# Altium schematic sheet CHANNEL_DELAY.SchDoc: Programmable delay
size 297 x 209 mm; CheckedBy: -; CompanyName: CERN; DrawnBy: GK; Organization: CERN; Address1: European Organization for Nuclear Research; Address2: CH-1211 Geneve 23 - Switzerland; Revision: -; SheetNumber: 8; SheetTotal: 9; EDA_Number: EDA-XXXXX-VX-X; Projet: FMC Delay 1ns 4cha; ModifiedBy: -; CreateDate: XX/XX/XXXX; CheckedDate: -; Title2: Title2; DivGrp: BE-CO; Designer: GK; ModifiedDate: -
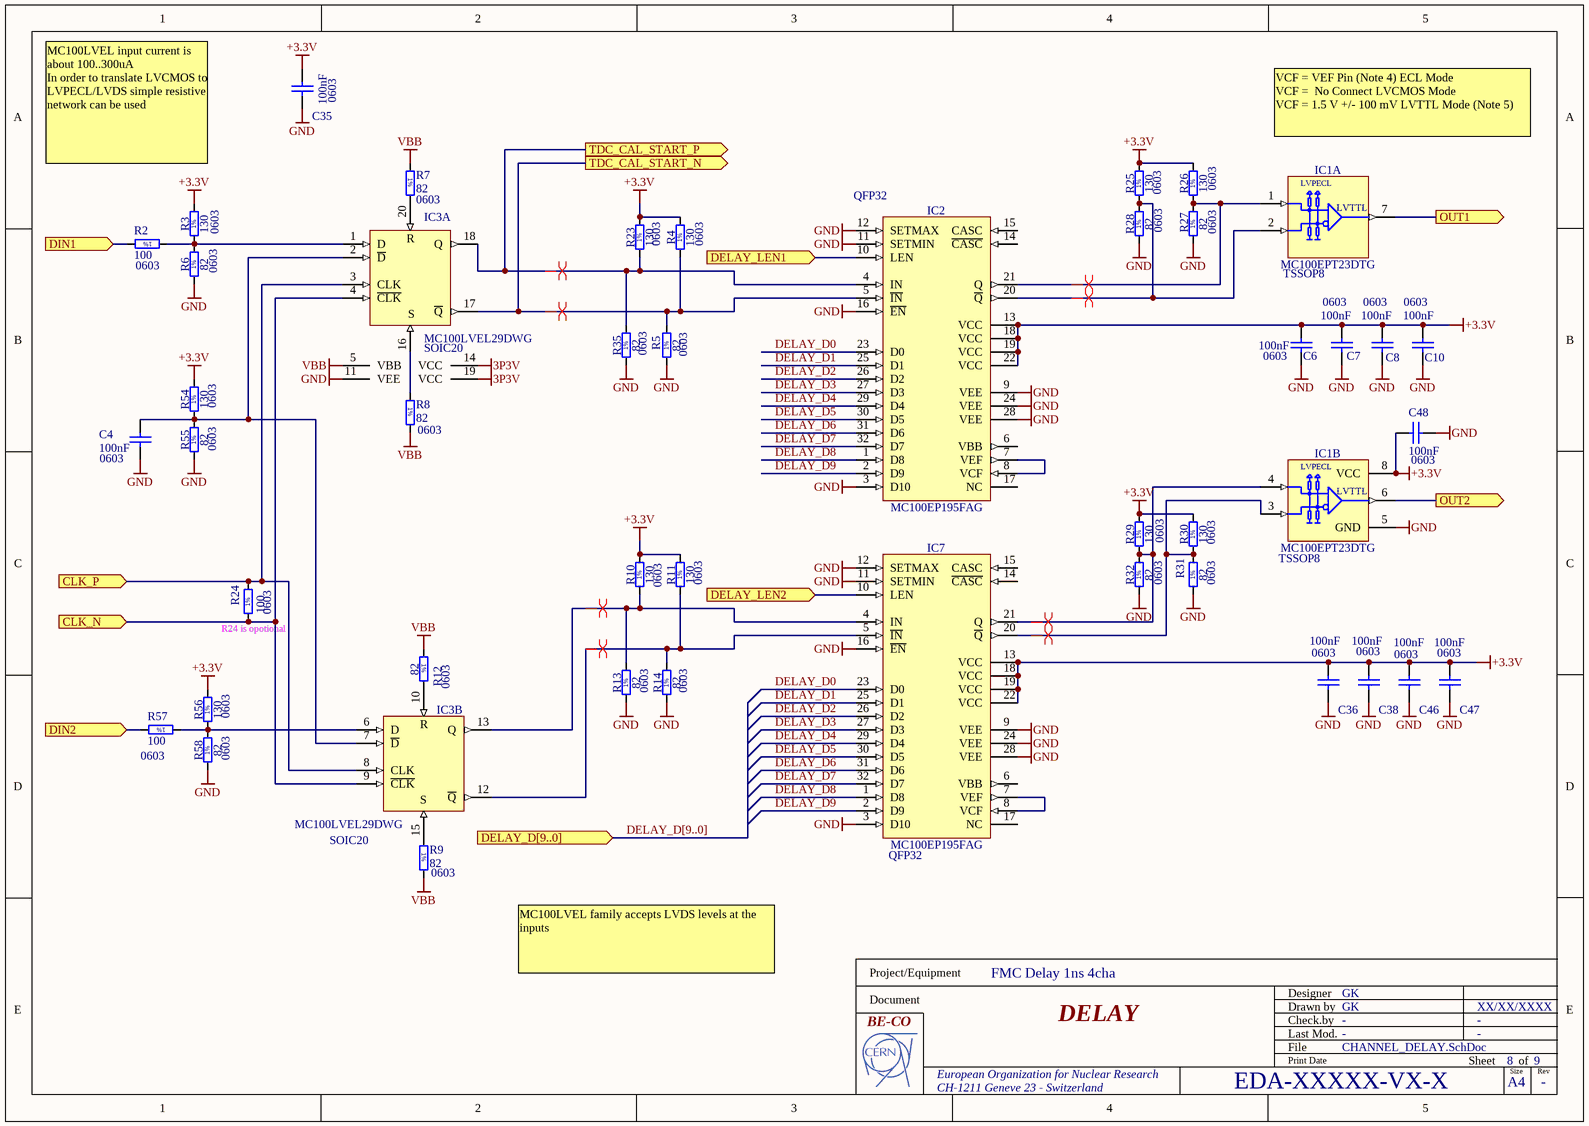
[diagram p0: CHANNEL_DELAY.SchDoc]

## Parts
C4  100nF  Case: 0603  [CAPC1608X87N]
C6  100nF  Case: 0603  [CAPC1608X87N]
C7  100nF  Case: 0603  [CAPC1608X87N]
C8  100nF  Case: 0603  [CAPC1608X87N]
C10  100nF  Case: 0603  [CAPC1608X87N]
C35  100nF  Case: 0603  [CAPC1608X87N]
C36  100nF  Case: 0603  [CAPC1608X87N]
C38  100nF  Case: 0603  [CAPC1608X87N]
C46  100nF  Case: 0603  [CAPC1608X87N]
C47  100nF  Case: 0603  [CAPC1608X87N]
C48  100nF  Case: 0603  [CAPC1608X87N]
IC1  MC100EPT23DTG  Case: TSSOP8  [SOP65P490X110-8N]  (parts A,B of 2)
IC2  MC100EP195FAG  Case: QFP32  [QFP80P900X900X160-32AN]
IC3  MC100LVEL29DWG  Case: SOIC20  [SOIC127P1030X265-20N]  (parts A,B of 2)
IC7  MC100EP195FAG  Case: QFP32  [QFP80P900X900X160-32AN]
R2  100  Case: 0603  [RESC1608X55N]
R3  130  Case: 0603  [RESC1608X55N]
R4  130  Case: 0603  [RESC1608X55N]
R5  82  Case: 0603  [RESC1608X55N]
R6  82  Case: 0603  [RESC1608X55N]
R7  82  Case: 0603  [RESC1608X55N]
R8  82  Case: 0603  [RESC1608X55N]
R9  82  Case: 0603  [RESC1608X55N]
R10  130  Case: 0603  [RESC1608X55N]
R11  130  Case: 0603  [RESC1608X55N]
R12  82  Case: 0603  [RESC1608X55N]
R13  82  Case: 0603  [RESC1608X55N]
R14  82  Case: 0603  [RESC1608X55N]
R23  130  Case: 0603  [RESC1608X55N]
R24  100  Case: 0603  [RESC1608X55N]
R25  130  Case: 0603  [RESC1608X55N]
R26  130  Case: 0603  [RESC1608X55N]
R27  82  Case: 0603  [RESC1608X55N]
R28  82  Case: 0603  [RESC1608X55N]
R29  130  Case: 0603  [RESC1608X55N]
R30  130  Case: 0603  [RESC1608X55N]
R31  82  Case: 0603  [RESC1608X55N]
R32  82  Case: 0603  [RESC1608X55N]
R35  82  Case: 0603  [RESC1608X55N]
R54  130  Case: 0603  [RESC1608X55N]
R55  82  Case: 0603  [RESC1608X55N]
R56  130  Case: 0603  [RESC1608X55N]
R57  100  Case: 0603  [RESC1608X55N]
R58  82  Case: 0603  [RESC1608X55N]

## Ports
CLK_N (in), CLK_P (in), DELAY_D[9..0] (in), DELAY_LEN1 (in), DELAY_LEN2 (in), DIN1 (in), DIN2 (in), OUT1 (out), OUT2 (out), TDC_CAL_START_N (out), TDC_CAL_START_P (out)

## Nets
+3.3V: C6.1 C7.1 C8.1 C10.1 C35.1 C36.1 C38.1 C46.1 C47.1 C48.1 IC1.8(VCC) IC2.13(VCC) IC2.18(VCC) IC2.19(VCC) IC2.22(VCC) IC3.14(VCC) IC3.19(VCC) IC7.13(VCC) IC7.18(VCC) IC7.19(VCC) IC7.22(VCC) R3.2 R4.2 R10.2 R11.2 R23.2 R25.2 R26.2 R29.2 R30.2 R54.2 R56.2  [also labelled 3P3V, VCC]
GND: C4.2 C6.2 C7.2 C8.2 C10.2 C35.2 C36.2 C38.2 C46.2 C47.2 C48.2 IC1.5(GND) IC2.3(D10) IC2.9(VEE) IC2.11(SETMIN) IC2.12(SETMAX) IC2.16(~{EN}) IC2.24(VEE) IC2.28(VEE) IC3.11(VEE) IC7.3(D10) IC7.9(VEE) IC7.11(SETMIN) IC7.12(SETMAX) IC7.16(~{EN}) IC7.24(VEE) IC7.28(VEE) R5.1 R6.1 R13.1 R14.1 R27.1 R28.1 R31.1 R32.1 R35.1 R55.1 R58.1  [also labelled VEE]
VBB: IC3.5(VBB) R7.1 R8.2 R9.2 R12.1
CLK_N: IC3.4(~{CLK}) IC3.9(~{CLK}) R24.1 ; port CLK_N
CLK_P: IC3.3(CLK) IC3.8(CLK) R24.2 ; port CLK_P
DELAY_D0: IC2.23(D0) IC7.23(D0)
DELAY_D1: IC2.25(D1) IC7.25(D1)
DELAY_D2: IC2.26(D2) IC7.26(D2)
DELAY_D3: IC2.27(D3) IC7.27(D3)
DELAY_D4: IC2.29(D4) IC7.29(D4)
DELAY_D5: IC2.30(D5) IC7.30(D5)
DELAY_D6: IC2.31(D6) IC7.31(D6)
DELAY_D7: IC2.32(D7) IC7.32(D7)
DELAY_D8: IC2.1(D8) IC7.1(D8)
DELAY_D9: IC2.2(D9) IC7.2(D9)
DELAY_LEN1: IC2.10(LEN) ; port DELAY_LEN1
DELAY_LEN2: IC7.10(LEN) ; port DELAY_LEN2
DIN1: R2.2 ; port DIN1
DIN2: R57.2 ; port DIN2
OUT1: IC1.7(Q0) ; port OUT1
OUT2: IC1.6(Q0) ; port OUT2
TDC_CAL_START_N: IC2.5(~{IN}) IC3.17(~{Q}) R4.1 R5.2 ; port TDC_CAL_START_N
TDC_CAL_START_P: IC2.4(IN) IC3.18(Q) R23.1 R35.2 ; port TDC_CAL_START_P
NetC4_1: C4.1 IC3.2(~{D}) IC3.7(~{D}) R54.1 R55.2
NetIC1_1: IC1.1(D0) IC2.21(Q) R26.1 R27.2
NetIC1_2: IC1.2(~{D0}) IC2.20(~{Q}) R25.1 R28.2
NetIC1_3: IC1.3(~{D0}) IC7.20(~{Q}) R30.1 R31.2
NetIC1_4: IC1.4(D0) IC7.21(Q) R29.1 R32.2
NetIC2_7: IC2.7(VEF) IC2.8(VCF)
NetIC3_1: IC3.1(D) R2.1 R3.1 R6.2
NetIC3_6: IC3.6(D) R56.1 R57.1 R58.2
NetIC3_10: IC3.10(R) R12.2
NetIC3_12: IC3.12(~{Q}) IC7.5(~{IN}) R11.1 R14.2
NetIC3_13: IC3.13(Q) IC7.4(IN) R10.1 R13.2
NetIC3_15: IC3.15(S) R9.1
NetIC3_16: IC3.16(S) R8.1
NetIC3_20: IC3.20(R) R7.2
NetIC7_7: IC7.7(VEF) IC7.8(VCF)

Not connected (* = marked no-connect by the designer): IC2 6(VBB) 14(~{CASC}) 15(CASC) 17(NC); IC7 6(VBB) 14(~{CASC}) 15(CASC) 17(NC)

## Buses and harness runs
bus DELAY_D[9..0] = port DELAY_D[9..0]

## Layout directives
differential pair: NetIC1_1, NetIC1_2, NetIC1_3, NetIC1_4, NetIC3_12, NetIC3_13, TDC_CAL_START_N, TDC_CAL_START_P

## Notes on the sheet
- VCF = VEF Pin (Note 4) ECL Mode
  VCF =  No Connect LVCMOS Mode
  VCF = 1.5 V +/- 100 mV LVTTL Mode (Note 5)
- (near R3) MC100LVEL input current is about 100..300uA
  In order to translate LVCMOS to LVPECL/LVDS simple resistive network can be used
- (near R24) R24 is opotional
- MC100LVEL family accepts LVDS levels at the inputs
- Project/Equipment
- Document
- DELAY
- Designer
- Drawn by
- Check.by
- File
- Last Mod.
- Print Date
- Sheet
- Size
- A4
- of
- Rev
- (in symbol MC100EPT23DTG, part A) LVPECL; LVTTL
- (in symbol MC100EPT23DTG, part B) LVPECL; LVTTL
- (in symbol R0603_82R_1%_0.1W_100PPM) 1%
- (in symbol R0603_100R_1%_0.1W_100PPM) 1%
- (in symbol R0603_130R_1%_0.1W_100PPM) 1%

## Library data of the parts
C4 C6-C8 C10 C35 C36 C38 C46-C48 = CC0603_100NF_50V_10%_X7R: Non-polarised capacitor; Manufacturer1 Part Number: 223858615649; Manufacturer: GENERIC; Part Description: SMD Multilayer Chip Ceramic Capacitor; Table: Capacitors SMD; TC: X7R; Tolerance: ±10%; Voltage: 50V; Author: CERN DEM JLC; Component Type: Standard; CreateDate: 03.12.2007; HelpURL: \\cern.ch\dfs\Applications\Altium\Datasheets\CC0603_X7R_PHYCOMP.pdf; LatestRevisionDate: 03.12.2007; Manufacturer1 ComponentHeight: 0.87mm; Manufacturer1 Example: PHYCOMP; Manufacturer Part Number: CC0603_100NF_50V_10%_X7R; Mounted: Yes; Pin Count: 2; SMD: Yes; Socket: No; Status: Preferred; Value: 100nF; Part Number: CC0603_100NF_50V_10%_X7R; Component Kind: Standard
IC1 = MC100EPT23DTG: 3.3V Dual Differential LVPECL/LVDS/CML  to LVTTL/LVCMOS Translator; Manufacturer: ON SEMICONDUCTOR; Table: Standard Logic; Part Number: MC100EPT23DTG; Component Kind: Standard; Component Type: Standard; Device: MC100EPT23DTG; PackageDescription: SOP, 0.65mm pitch; 8 pin, 3.00mm W X 3.00mm L X 1.10mm H body, IPC Medium Density; Part Description: 3.3V Dual Differential LVPECL/LVDS/CML  to LVTTL/LVCMOS Translator; Manufacturer Part Number: MC100EPT23DTG; Pin Count: 8; Mounted: Yes; Socket: No; SMD: Yes; ComponentHeight: 1.1mm; Author: CERN DEM JLC; HelpURL: \\cern.ch\dfs\Applications\Altium\Datasheets\MC100EPT23DTG.pdf; CreateDate: 2010-07-06; LatestRevisionDate: 2010-07-06
IC2 IC7 = MC100EP195FAG: 3.3V ECL Programmable Delay Chip; Part Number: MC100EP195BFAG; Manufacturer: ON SEMICONDUCTOR; Table: Standard Logic; Component Kind: Standard; Component Type: Standard; Device: MC100EP195FAG; PackageDescription: QFP,0.80mm Pitch, Square; 32 Pin, 7.00mm L X 7.00mm W X 1.60mm H Body, IPC Medium Density; Part Description: 3.3 V ECL Programmable Delay Chip; Manufacturer Part Number: MC100EP195FAG; Pin Count: 32; Mounted: Yes; Socket: No; SMD: Yes; ComponentHeight: 1.6mm; Author: CERN DEM JLC; HelpURL: \\cern.ch\dfs\Applications\Altium\Datasheets\MC100EP195FAG.pdf; CreateDate: 2010-04-15; LatestRevisionDate: 2010-04-15
IC3 = MC100LVEL29DWG: 3.3V ECL Dual Differential Data and Clock D Flip-Flop With Set and Reset; Manufacturer: ON SEMICONDUCTOR; Table: Standard Logic; Part Number: MC100LVEL29DWG; Component Kind: Standard; Component Type: Standard; Device: MC100LVEL29DWG; PackageDescription: SOIC 20, Pitch 1.27mm - Body 7.5x12.8mm, IPC Medium Density; Part Description: 3.3V ECL Dual Differential Data and Clock D Flip-Flop With Set and Reset; Manufacturer Part Number: MC100LVEL29DWG; Pin Count: 20; Mounted: Yes; Socket: No; SMD: Yes; ComponentHeight: 2.65mm; Author: CERN DEM JLC; HelpURL: \\cern.ch\dfs\Applications\Altium\Datasheets\MC100LVEL29DWG.pdf; CreateDate: 2010-07-06; LatestRevisionDate: 2010-07-06
R2 R24 R57 = R0603_100R_1%_0.1W_100PPM: Resistor - 1%; Part Description: General Purpose Thick Film Chip Resistor; Manufacturer: GENERIC; Manufacturer1 Part Number: NRC06F4700TRF; Power: 0.1W; TC: ±100ppm/°C; Table: Resistors SMD; Part Number: R0603_100R_1%_0.1W_100PPM; Component Kind: Standard; Component Type: Standard; Pin Count: 2; Value: 100; Status: Preferred; Tolerance: ±1%; Manufacturer Part Number: R0603_100R_1%_0.1W_100PPM; Mounted: Yes; Socket: No; SMD: Yes; Manufacturer1 Example: NIC COMPONENT; Manufacturer1 ComponentHeight: 0.55mm; HelpURL: \\cern.ch\dfs\Applications\Altium\Datasheets\R0603_NIC_NRC.pdf; Author: CERN DEM JLC; CreateDate: 2007-12-03; LatestRevisionDate: 2008-03-13
R3 R4 R10 R11 R23 R25 R26 R29 R30 R54 R56 = R0603_130R_1%_0.1W_100PPM: Resistor - 1%; Part Description: General Purpose Thick Film Chip Resistor; Manufacturer: GENERIC; Manufacturer1 Part Number: NRC06F1300TRF; Power: 0.1W; TC: ±100ppm/°C; Table: Resistors SMD; Part Number: R0603_130R_1%_0.1W_100PPM; Component Kind: Standard; Component Type: Standard; Pin Count: 2; Value: 130; Status: Preferred; Tolerance: ±1%; Manufacturer Part Number: R0603_130R_1%_0.1W_100PPM; Mounted: Yes; Socket: No; SMD: Yes; Manufacturer1 Example: NIC COMPONENT; Manufacturer1 ComponentHeight: 0.55mm; HelpURL: \\cern.ch\dfs\Applications\Altium\Datasheets\R0603_NIC_NRC.pdf; Author: CERN DEM JLC; CreateDate: 2007-12-03; LatestRevisionDate: 2008-03-13
R5-R9 R12-R14 R27 R28 R31 R32 R35 R55 R58 = R0603_82R_1%_0.1W_100PPM: Resistor - 1%; Part Description: General Purpose Thick Film Chip Resistor; Manufacturer: GENERIC; Manufacturer1 Part Number: NRC06F82R0TRF; Power: 0.1W; TC: ±100ppm/°C; Table: Resistors SMD; Part Number: R0603_82R_1%_0.1W_100PPM; Component Kind: Standard; Component Type: Standard; Pin Count: 2; Value: 82; Status: Preferred; Tolerance: ±1%; Manufacturer Part Number: R0603_82R_1%_0.1W_100PPM; Mounted: Yes; Socket: No; SMD: Yes; Manufacturer1 Example: NIC COMPONENT; Manufacturer1 ComponentHeight: 0.55mm; HelpURL: \\cern.ch\dfs\Applications\Altium\Datasheets\R0603_NIC_NRC.pdf; Author: CERN DEM JLC; CreateDate: 2007-12-03; LatestRevisionDate: 2008-03-13